# Altium schematic sheet Wolf-Lite_LPF.SchDoc
size 594 x 420 mm; Address1: Address1; Address2: Address2; Address3: Address3; Address4: Address4; DocumentNumber: АБВГ.123456.001 Э3; SheetNumber: 2; Scale: 1:1; DocumentType: Схема электрическая принципиальная; FirstReferrence: АБВГ.123456.001
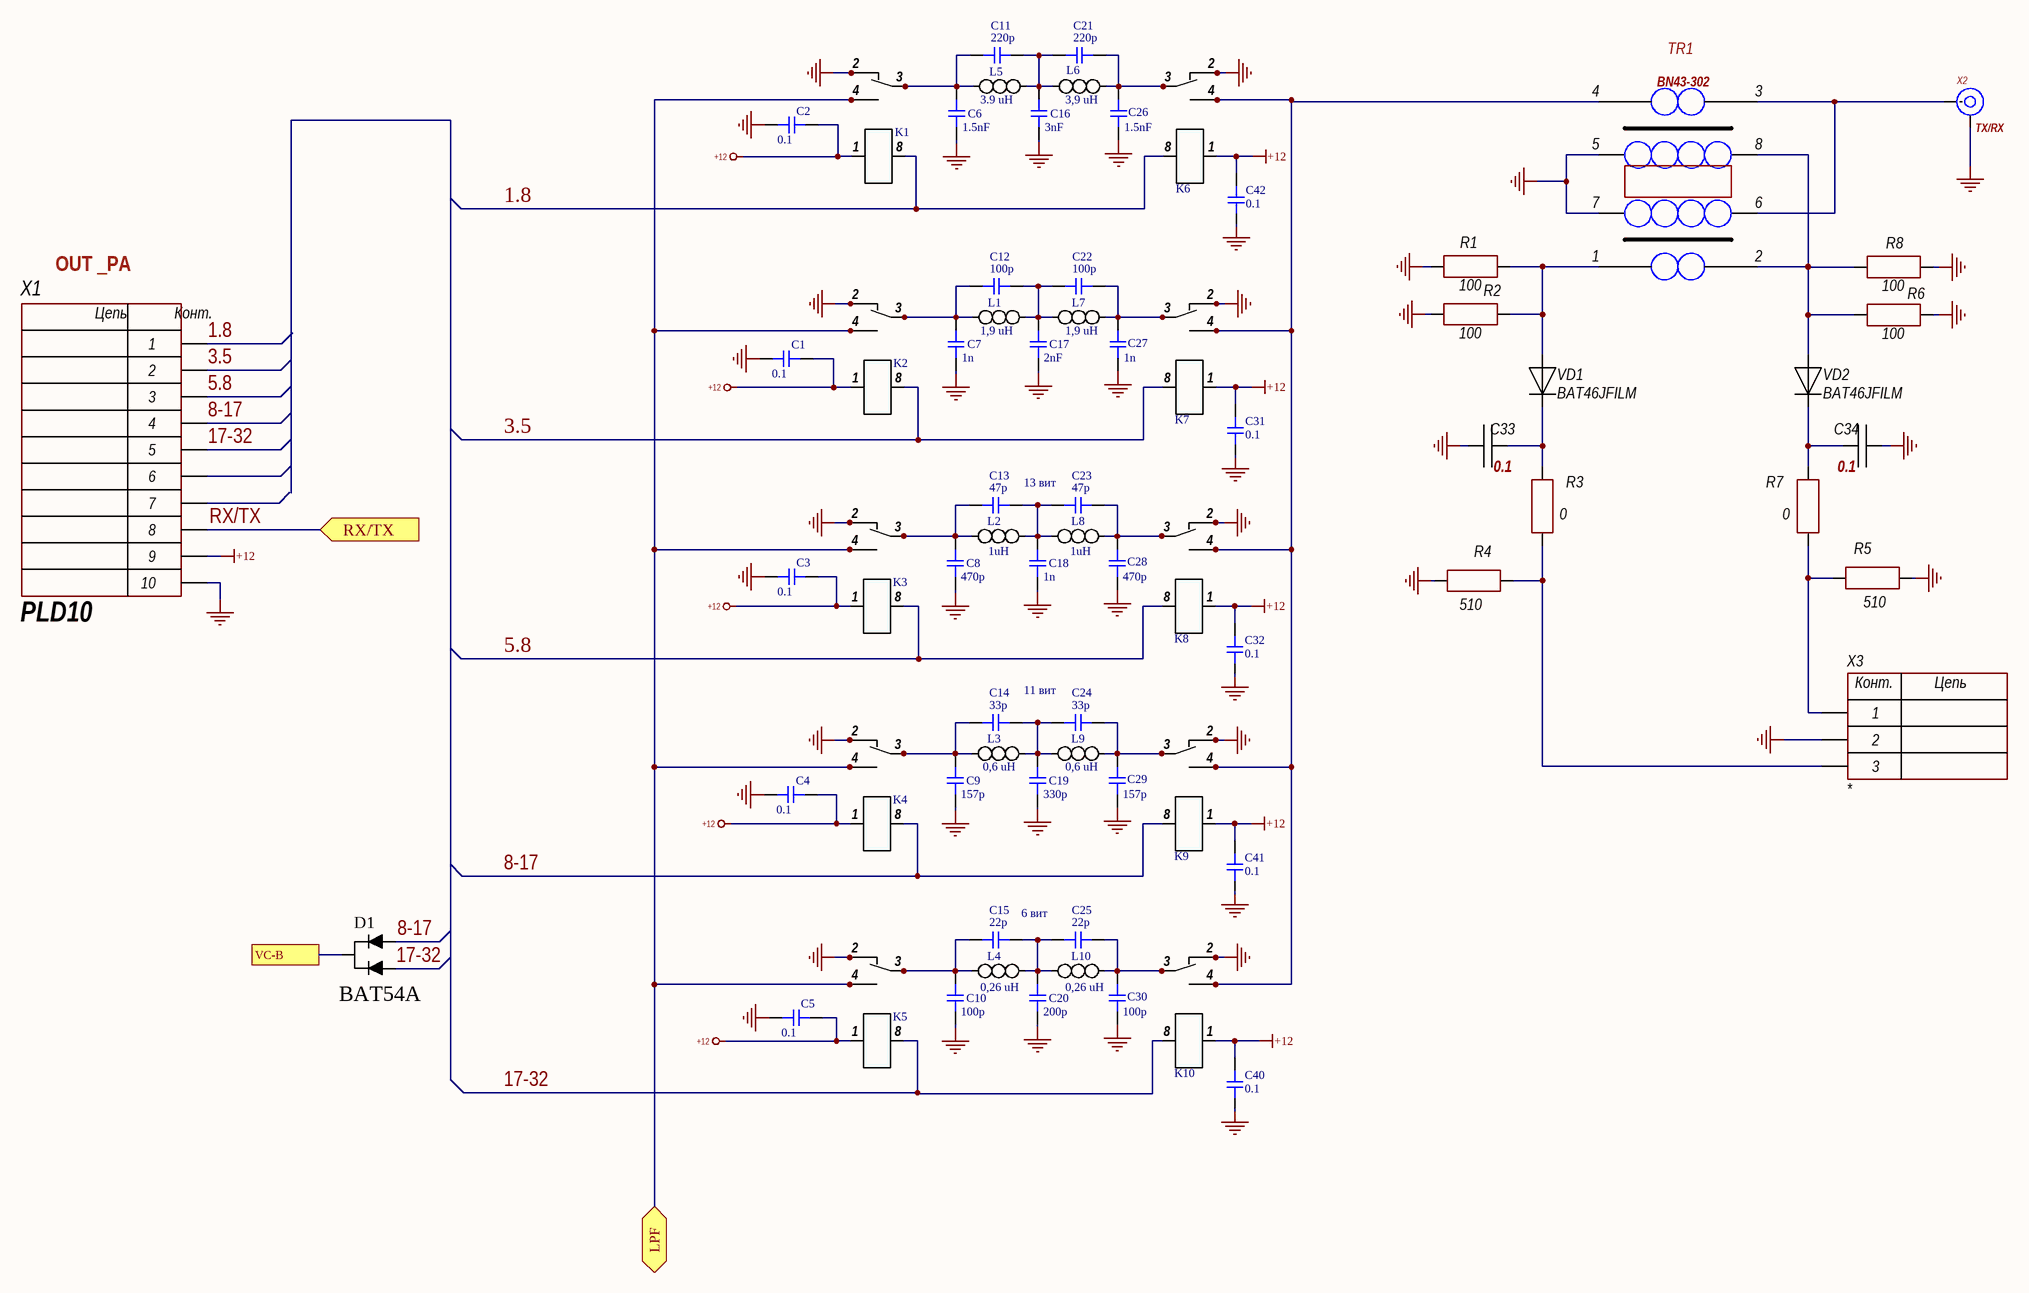
[diagram p0: Wolf-Lite_LPF.SchDoc]

## Parts
C1  0.1  [CH0805C]
C2  0.1  [CH0805C]
C3  0.1  [CH0805C]
C4  0.1  [CH0805C]
C5  0.1  [CH0805C]
C6  1.5nF  [CH1206C]
C7  1n  [CH1206C]
C8  470p  [CH1206C]
C9  157p  [CH1206C]
C10  100p  [CH1206C]
C11  220p  [CH1206C]
C12  100p  [CH1206C]
C13  47p  [CH1206C]
C14  33p  [CH1206C]
C15  22p  [CH1206C]
C16  3nF  [CH1206C]
C17  2nF  [CH1206C]
C18  1n  [CH1206C]
C19  330p  [CH1206C]
C20  200p  [CH1206C]
C21  220p  [CH1206C]
C22  100p  [CH1206C]
C23  47p  [CH1206C]
C24  33p  [CH1206C]
C25  22p  [CH1206C]
C26  1.5nF  [CH1206C]
C27  1n  [CH1206C]
C28  470p  [CH1206C]
C29  157p  [CH1206C]
C30  100p  [CH1206C]
C31  0.1  [CH0805C]
C32  0.1  [CH0805C]
C33  0.1  [CH0805C]
C34  0.1  [CH0805C]
C40  0.1  [CH0805C]
C41  0.1  [CH0805C]
C42  0.1  [CH0805C]
D1  BAT54A  [SOT23_132]
K1  Relay_IM06 GR 12v to BPF  [IM06]  (value not drawn)
K2  Relay_IM06 GR 12v to BPF  [IM06]  (value not drawn)
K3  Relay_IM06 GR 12v to BPF  [IM06]  (value not drawn)
K4  Relay_IM06 GR 12v to BPF  [IM06]  (value not drawn)
K5  Relay_IM06 GR 12v to BPF  [IM06]  (value not drawn)
K6  Relay_IM06 GR 12v to BPF  [IM06]  (value not drawn)
K7  Relay_IM06 GR 12v to BPF  [IM06]  (value not drawn)
K8  Relay_IM06 GR 12v to BPF  [IM06]  (value not drawn)
K9  Relay_IM06 GR 12v to BPF  [IM06]  (value not drawn)
K10  Relay_IM06 GR 12v to BPF  [IM06]  (value not drawn)
L1  1,9 uH  [T50-2]
L2  1uH  [T50-6]
L3  0,6 uH  [T50-6]
L4  0,26 uH  [T50-6]
L5  3.9 uH  [T50-2]
L6  3,9 uH  [T50-2]
L7  1,9 uH  [T50-2]
L8  1uH  [T50-6]
L9  0,6 uH  [T50-6]
L10  0,26 uH  [T50-6]
R1  100  [CH1206R]
R2  100  [CH1206R]
R3  0  [CH0805R]
R4  510  [CH0805R]
R5  510  [CH0805R]
R6  100  [CH1206R]
R7  0  [CH0805R]
R8  100  [CH1206R]
TR1  BN43-302  [TANDEM]
VD1  BAT46JFILM  [D9B]
VD2  BAT46JFILM  [D9B]
X1  PLD10  [CON: PLD-10]
X2  TX/RX  [Connect]
X3  *  [CON: CWF-3]

## Ports
LPF (bidir), RX/TX (in), VC-B

## Nets
+12: C1.2 C2.2 C3.2 C4.2 C5.2 C31.2 C32.2 C40.2 C41.2 C42.2 K1.1 K2.1 K3.1 K4.1 K5.1 K6.1 K7.1 K8.1 K9.1 K10.1 X1.9
GND: C1.1 C2.1 C3.1 C4.1 C5.1 C6.2 C7.2 C8.2 C9.2 C10.2 C16.2 C17.2 C18.2 C19.2 C20.2 C26.2 C27.2 C28.2 C29.2 C30.2 C31.1 C32.1 C33.2 C34.2 C40.1 C41.1 C42.1 K1.2 K1.7 K2.2 K2.7 K3.2 K3.7 K4.2 K4.7 K5.2 K5.7 K6.2 K6.7 K7.2 K7.7 K8.2 K8.7 K9.2 K9.7 K10.2 K10.7 R1.2 R2.2 R4.1 R5.1 R6.2 R8.2 TR1.5 TR1.7 X1.10 X2.2(IN) X3.2
1.8: K1.8 K6.8 X1.1
3.5: K2.8 K7.8 X1.2
5.8: K3.8 K8.8 X1.3
8-17: D1.1 K4.8 K9.8 X1.4
17-32: D1.2 K5.8 K10.8 X1.5
LPF: K1.4 K1.5 K2.4 K2.5 K3.4 K3.5 K4.4 K4.5 K5.4 K5.5 ; port LPF
RX/TX: X1.8 ; port RX/TX
VC-B: D1.3 ; port VC-B
NetC6_1: C6.1 C11.2 K1.3 K1.6 L5.1
NetC7_1: C7.1 C12.2 K2.3 K2.6 L1.1
NetC8_1: C8.1 C13.2 K3.3 K3.6 L2.1
NetC9_1: C9.1 C14.2 K4.3 K4.6 L3.1
NetC10_1: C10.1 C15.2 K5.3 K5.6 L4.1
NetC11_1: C11.1 C16.1 C21.2 L5.2 L6.1
NetC12_1: C12.1 C17.1 C22.2 L1.2 L7.1
NetC13_1: C13.1 C18.1 C23.2 L2.2 L8.1
NetC14_1: C14.1 C19.1 C24.2 L3.2 L9.1
NetC15_1: C15.1 C20.1 C25.2 L4.2 L10.1
NetC21_1: C21.1 C26.1 K6.3 K6.6 L6.2
NetC22_1: C22.1 C27.1 K7.3 K7.6 L7.2
NetC23_1: C23.1 C28.1 K8.3 K8.6 L8.2
NetC24_1: C24.1 C29.1 K9.3 K9.6 L9.2
NetC25_1: C25.1 C30.1 K10.3 K10.6 L10.2
NetC33_1: C33.1 R3.1 VD1.2
NetC34_1: C34.1 R7.1 VD2.2
NetK6_4: K6.4 K6.5 K7.4 K7.5 K8.4 K8.5 K9.4 K9.5 K10.4 K10.5 TR1.4
NetR1_1: R1.1 R2.1 TR1.1 VD1.1
NetR3_2: R3.2 R4.2 X3.3
NetR5_2: R5.2 R7.2 X3.1
NetR6_1: R6.1 R8.1 TR1.2 TR1.8 VD2.1
NetTR1_3: TR1.3 TR1.6 X2.1(IN)

Not connected (* = marked no-connect by the designer): X1 6 7

## Notes on the sheet
- OUT _PA
- 13 вит
- 11 вит
- 6 вит
- Перв. примен.
- Справ. №
- Подп. и дата
- Инв. № дубл.
- Взам. инв. №
- Инв. № подл.
- Изм.
- Лист
- № докум.
- Подп.
- Дата
- 2.106-A2
- Копировал
- Формат А2
- (in symbol 3-Connector) Конт.; Цепь
- (in symbol 10-Connector) Цепь; Конт.

## Library data of the parts
C1-C32 C40-C42 = C_smd
C33 C34 = Capacitor: Manufacturer: *; Model: *; HelpURL: *; ComponentKind: *; Value: *
D1 = BAT54
L1-L10 = L
R1-R8 = Resistor: Manufacturer: *; Model: *; HelpURL: *; ComponentKind: *; Value: *
VD1 VD2 = Diod: ComponentKind: *; Manufacturer: *; Model: *; HelpURL: *
X1 = 10-Connector: Model: *; Manufacturer: *; HelpURL: *; ComponentKind: *
X2 = SMA: RF; System: Connector; Model: *; Manufacturer: *; HelpURL: *; ComponentKind: *
X3 = 3-Connector: Model: *; Manufacturer: *; HelpURL: *; ComponentKind: *